# EAGLE design Full_PCB2 (EAGLE 9.6.2)
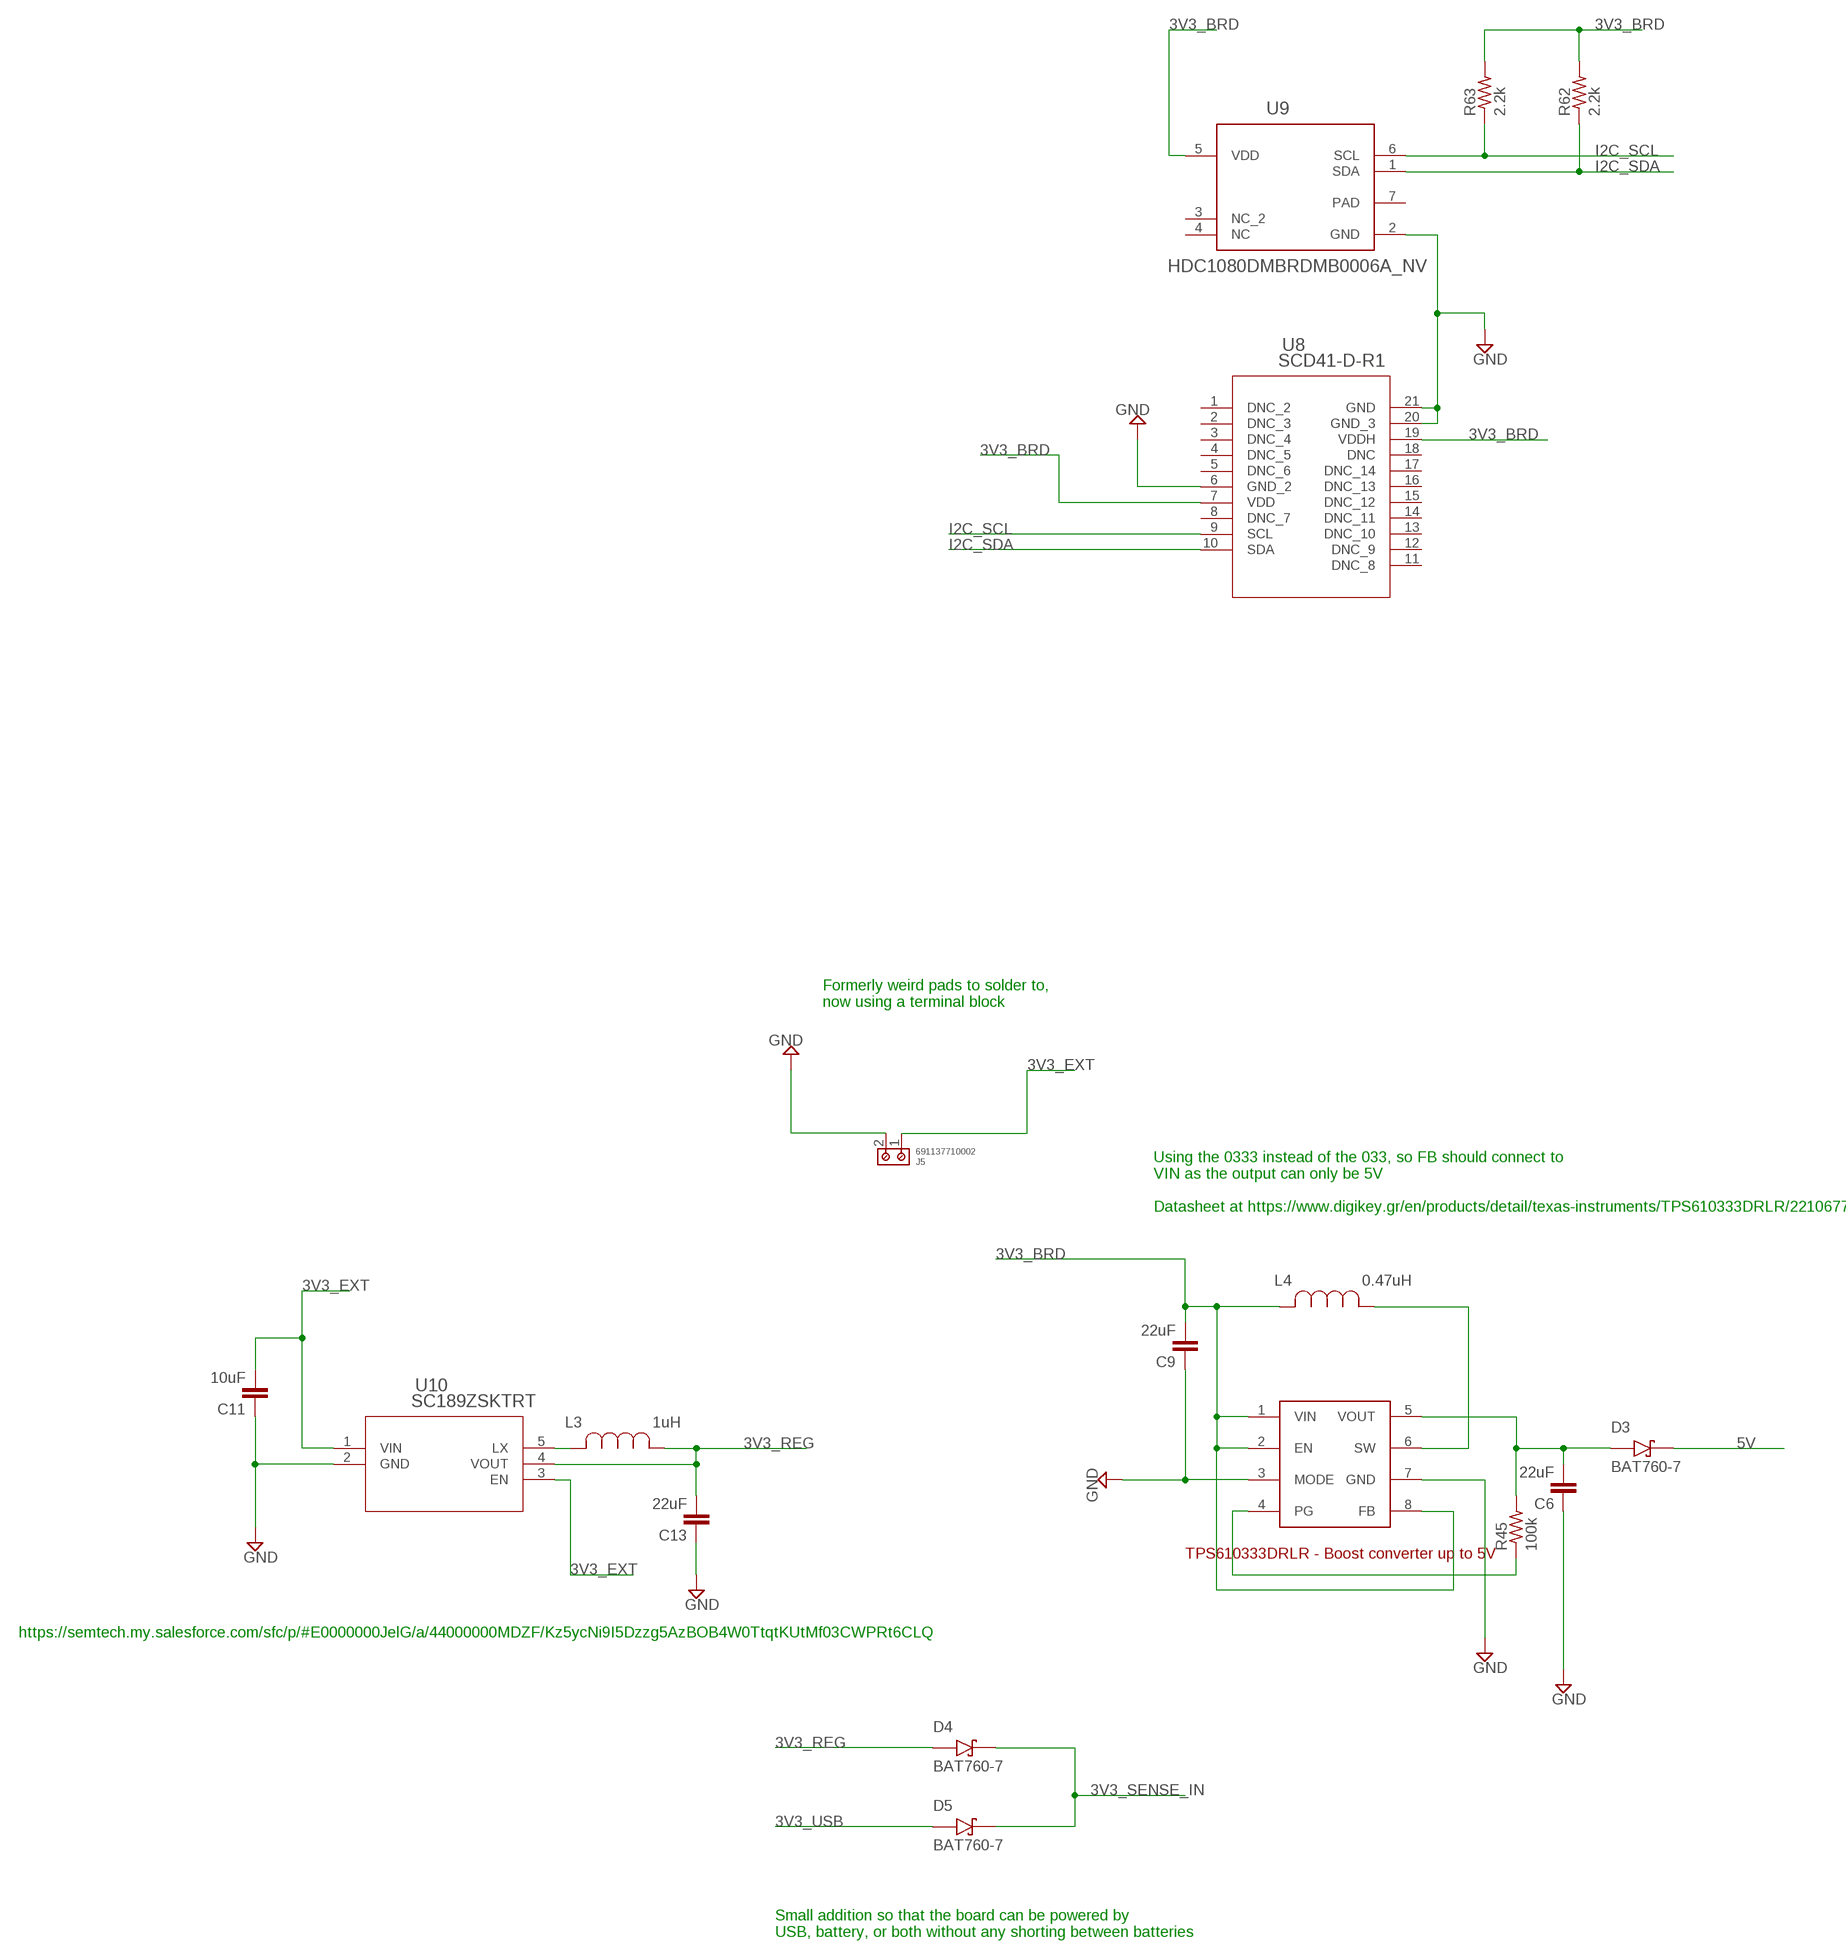
[diagram p0: schematic, sheet 1, part 1 of 3]
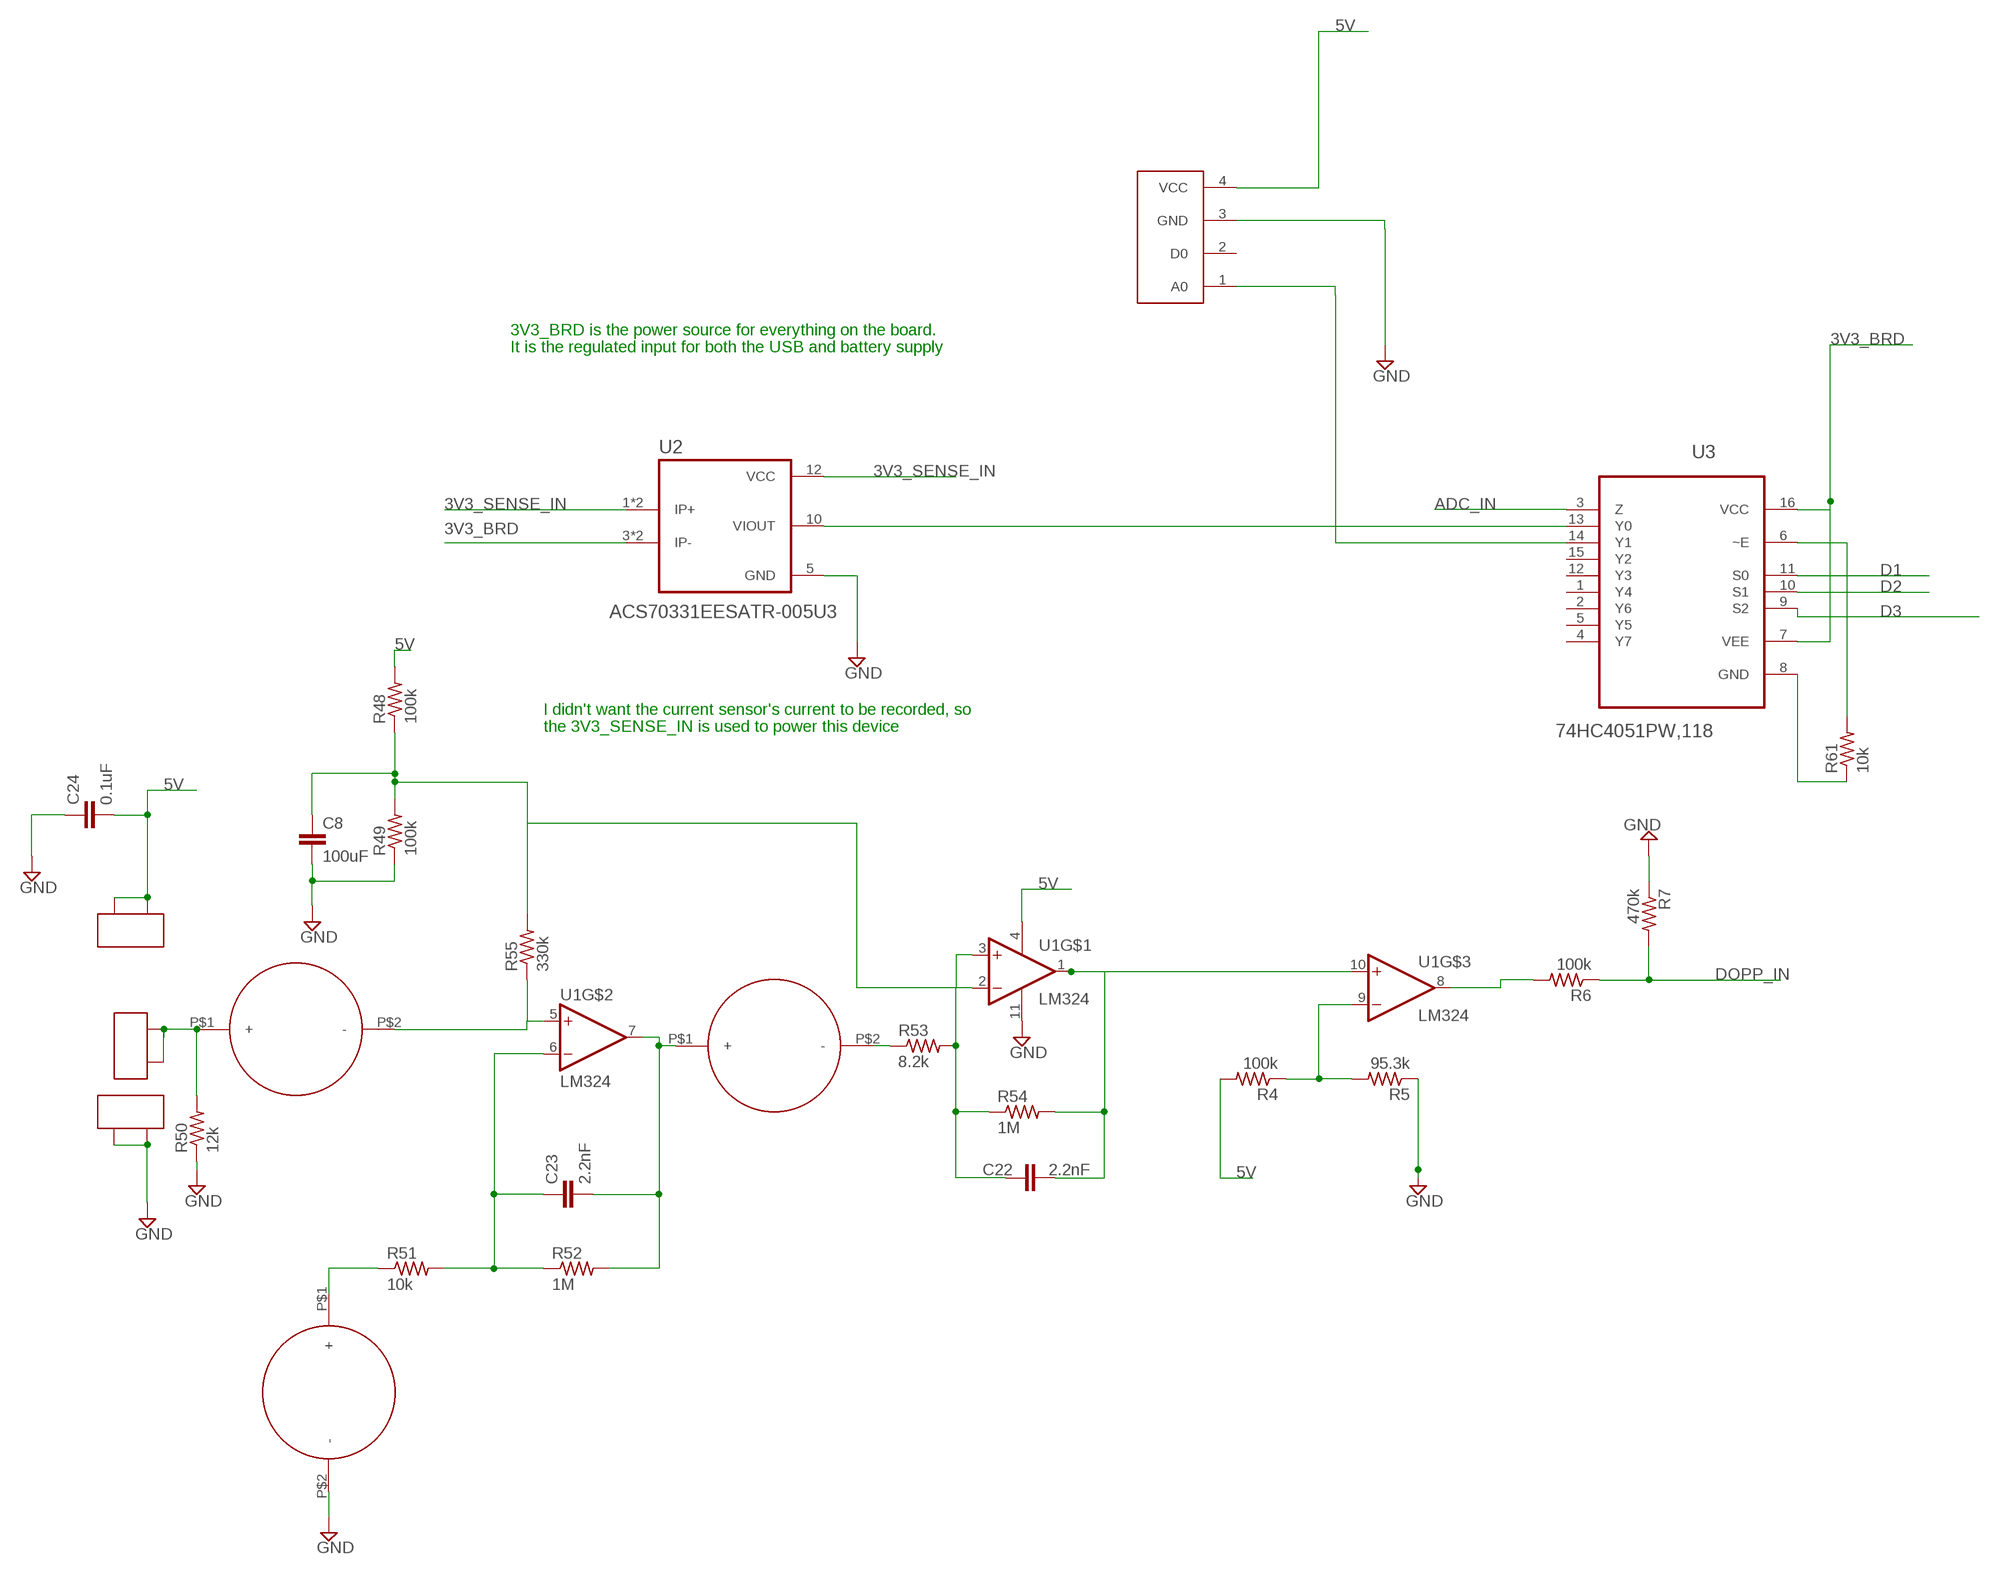
[diagram p1: schematic, sheet 1, part 2 of 3]
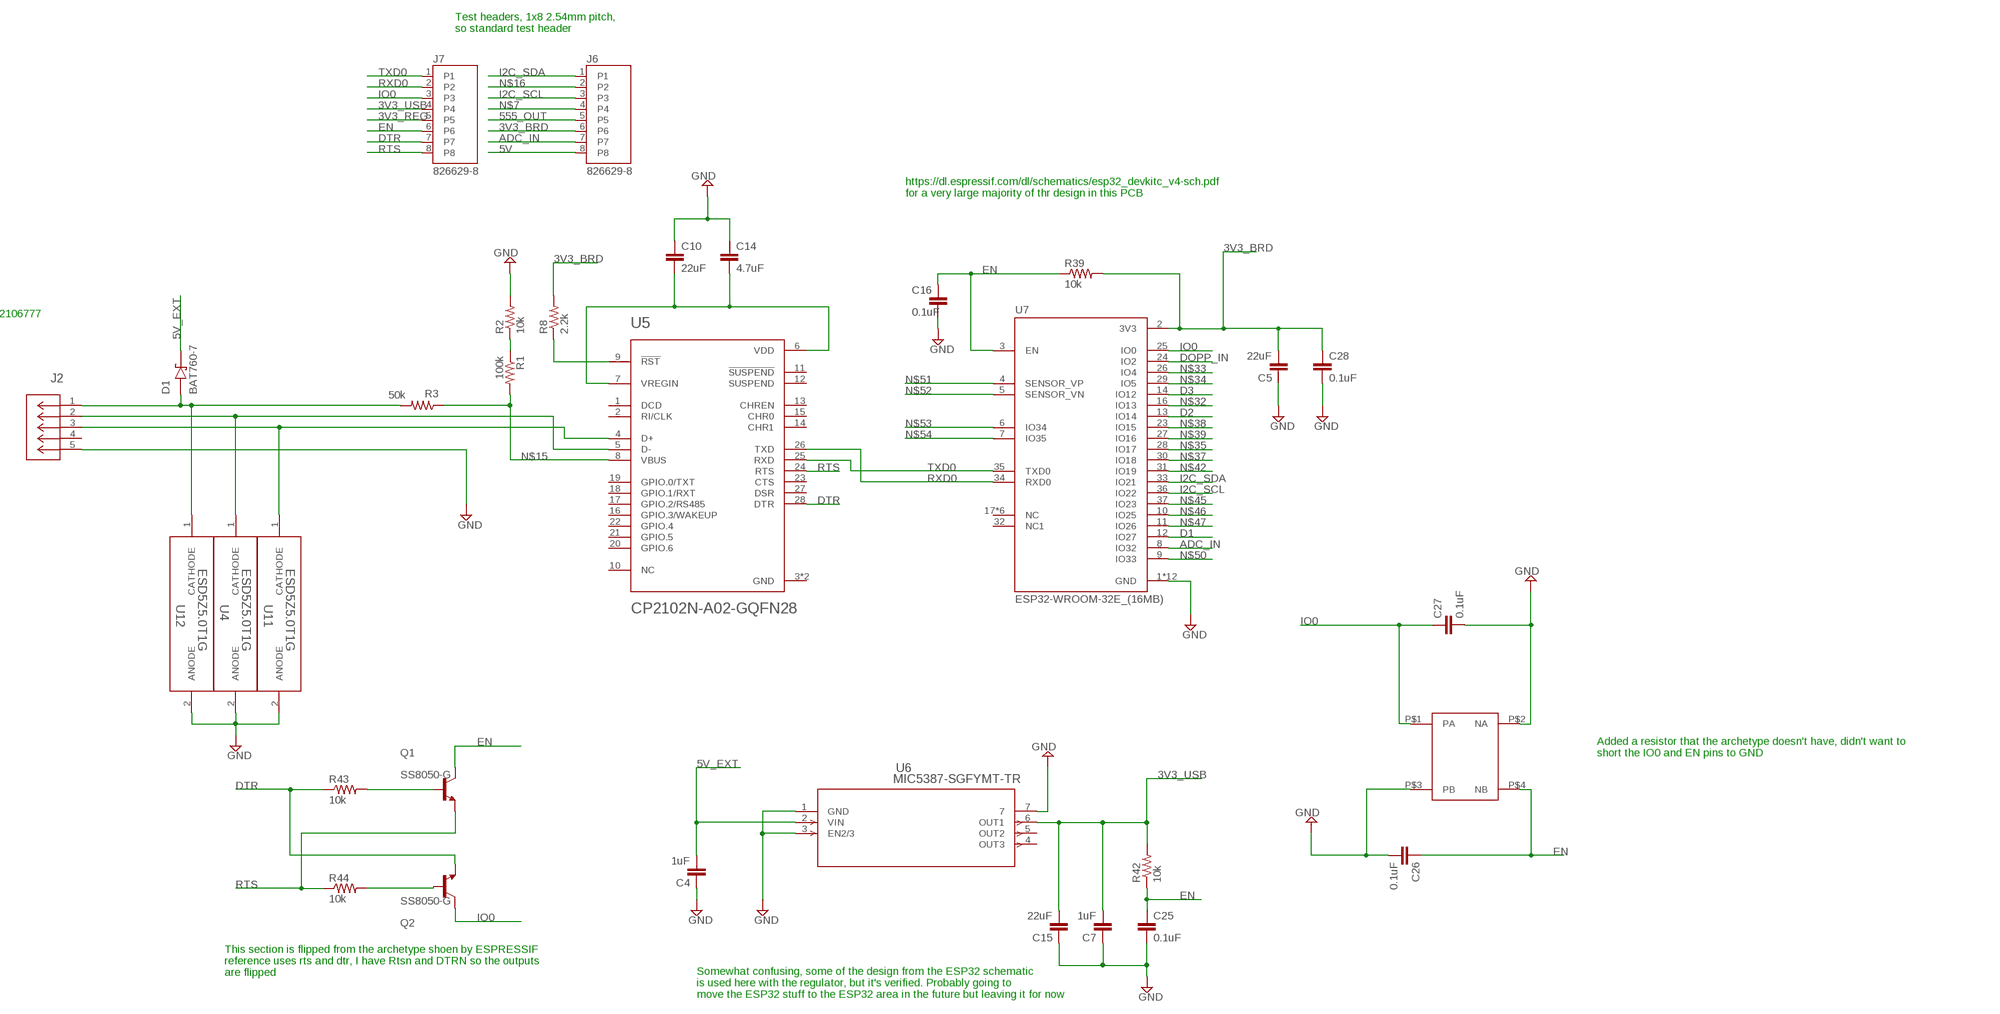
[diagram p2: schematic, sheet 1, part 3 of 3]

## Parts
C4  1uF  C-EUC0603  [C0603]
C5  22uF  C-EUC0603  [C0603]
C6  22uF  C-EUC0603  [C0603]
C7  1uF  C-EUC0603  [C0603]
C8  100uF  C-EUC1206  [C1206]
C9  22uF  C-EUC0603  [C0603]
C10  22uF  C-EUC0805  [C0805]
C11  10uF  C-EUC0603  [C0603]
C13  22uF  C-EUC0603  [C0603]
C14  4.7uF  C-EUC0402  [C0402]
C15  22uF  C-EUC0603  [C0603]
C16  0.1uF  C-EUC0402  [C0402]
C22  2.2nF  C-EUC0402  [C0402]
C23  2.2nF  C-EUC0402  [C0402]
C24  0.1uF  C-EUC0402  [C0402]
C25  0.1uF  C-EUC0402  [C0402]
C26  0.1uF  C-EUC0402  [C0402]
C27  0.1uF  C-EUC0402  [C0402]
C28  0.1uF  C-EUC0402  [C0402]
D1  BAT760-7  [SOD2513X120N]
D3  BAT760-7  [SOD2513X120N]
D4  BAT760-7  [SOD2513X120N]
D5  BAT760-7  [SOD2513X120N]
J2  10118193-0001LF  [CONN_10118193-0001LF_AMP]
J5  691137710002  [691137710002]
J6  826629-8  [TE_826629-8]
J7  826629-8  [TE_826629-8]
L3  1uH  DFE252012P-1R0M=P2  [DFE252012P-1R0M=P2]
L4  0.47uH  DFE252012P-1R0M=P2  [DFE252012P-1R0M=P2]
Q1  SS8050-G  [TRANS_SS8050-G]
Q2  SS8050-G  [TRANS_SS8050-G]
R1  100k  R-US_R0402  [R0402]
R2  10k  R-US_R0402  [R0402]
R3  50k  R-US_R0402  [R0402]
R4  100k  R-US_R0402  [R0402]
R5  95.3k  R-US_R0402  [R0402]
R6  100k  R-US_R0402  [R0402]
R7  470k  R-US_R0402  [R0402]
R8  2.2k  R-US_R0402  [R0402]
R39  10k  R-US_R0402  [R0402]
R42  10k  R-US_R0402  [R0402]
R43  10k  R-US_R0402  [R0402]
R44  10k  R-US_R0402  [R0402]
R45  100k  R-US_R0402  [R0402]
R48  100k  R-US_R0402  [R0402]
R49  100k  R-US_R0402  [R0402]
R50  12k  R-US_R0402  [R0402]
R51  10k  R-US_R0402  [R0402]
R52  1M  R-US_R0402  [R0402]
R53  8.2k  R-US_R0402  [R0402]
R54  1M  R-US_R0402  [R0402]
R55  330k  R-US_R0402  [R0402]
R61  10k  R-US_R0402  [R0402]
R62  2.2k  R-US_R0402  [R0402]
R63  2.2k  R-US_R0402  [R0402]
U1  LM324  [SOIC127P600X175-14N]
U2  ACS70331EESATR-005U3  [ALLEGRO_ACS70331EESATR-005U3]
U3  74HC4051PW,118  [SOP65P640X110-16N]
U4  ESD5Z5.0T1G  [SOD-523_0P9X1P3_ONS]
U5  CP2102N-A02-GQFN28  [QFN50P500X500X80-29N]
U6  MIC5387-SGFYMT-TR  [MLF-6_MT_MCH]
U7  ESP32-WROOM-32E_(16MB)  [XCVR_ESP32-WROOM-32E_(16MB)]
U8  SCD41-D-R1  [SCD41-D-R1_SEN]
U9  HDC1080DMBRDMB0006A_NV  [DMB0006A_NV]
U10  SC189ZSKTRT  [SOT23-5-SC189_SEM]
U11  ESD5Z5.0T1G  [SOD-523_0P9X1P3_ONS]
U12  ESD5Z5.0T1G  [SOD-523_0P9X1P3_ONS]
U14  TPS610333DRLR  [TPS610333DRLR]
U$1  2PIN_HEADER  [2PIN_HEADER]
U$2  2PIN_HEADER  [2PIN_HEADER]
U$3  MQ_7  [MQ-7]
U$5  2PIN_HEADER  [2PIN_HEADER]
U$6  219-2LPST  [219-2LPST]
U$7  865080540002  [865080540002]
U$8  865080540002  [865080540002]
U$9  865080540002  [865080540002]

## Nets
3V3_BRD: C5.2 C9.2 C28.1 J6.6 L4.2 R8.2 R39.2 R62.2 R63.2 U2.3(IP-) U2.4(IP-) U3.7(VEE) U3.16(VCC) U7.2(3V3) U8.7(VDD) U8.19(VDDH) U9.5(VDD) U14.1(VIN) U14.2(EN) U14.8(FB)
3V3_EXT: C11.2 J5.1 U10.1(VIN) U10.3(EN)
3V3_REG: C13.2 D4.A J7.5 L3.1 U10.4(VOUT)
3V3_SENSE_IN: D4.C(K) D5.C(K) U2.1(IP+) U2.2(IP+) U2.12(VCC)
3V3_USB: C7.2 C15.2 D5.A J7.4 R42.2 U6.6(OUT1)
5V: C24.2 D3.C(K) J6.8 R4.2 R48.2 U1.4(VCC+) U$2.1 U$2.2 U$3.4(VCC)
5V1: C6.2 D3.A R45.2 U14.5(VOUT)
5V_EXT: C4.2 D1.C(K) U6.2(VIN)
555_OUT: J6.5
ADC_IN: J6.7 U3.3(Z) U7.8(IO32)
D1: U3.11(S0) U7.12(IO27)
D2: U3.10(S1) U7.13(IO14)
D3: U3.9(S2) U7.14(IO12)
DOPP_IN: R6.1 R7.2 U7.24(IO2)
DTR: J7.7 Q2.2(E) R43.1 U5.28(DTR)
EN: C16.1 C25.1 C26.1 J7.6 Q1.3(C) R39.1 R42.1 U7.3(EN) U$6.P$4(NB)
GND: C4.1 C5.1 C6.1 C7.1 C8.2 C9.1 C10.1 C11.1 C13.1 C14.1 C15.1 C16.2 C24.1 C25.2 C26.2 C27.2 C28.2 J2.5 J5.2 R2.2 R5.1 R7.1 R49.1 R50.1 U1.11(VCC-) U2.5(GND) U4.2(ANODE) U6.1(GND) U6.3(EN2/3) U6.7 U7.1(GND) U7.15(GND) U7.38(GND) U7.39_1(GND) U7.39_2(GND) U7.39_3(GND) U7.39_4(GND) U7.39_5(GND) U7.39_6(GND) U7.39_7(GND) U7.39_8(GND) U7.39_9(GND) U8.6(GND_2) U8.20(GND_3) U8.21(GND) U9.2(GND) U10.2(GND) U11.2(ANODE) U12.2(ANODE) U14.3(MODE) U14.7(GND) U$3.3(GND) U$5.1 U$5.2 U$6.P$2(NA) U$6.P$3(PB) U$7.P$2(-)
I2C_SCL: J6.3 R63.1 U7.36(IO22) U8.9(SCL) U9.6(SCL)
I2C_SDA: J6.1 R62.1 U7.33(IO21) U8.10(SDA) U9.1(SDA)
IO0: C27.1 J7.3 Q2.3(C) U7.25(IO0) U$6.P$1(PA)
N$1: D1.A J2.1 R3.2 U12.1(CATHODE)
N$2: R4.1 R5.2 U1.9(INVERTING_INPUT3)
N$3: C23.1 R51.2 R52.1 U1.6(INVERTING_INPUT2)
N$4: C23.2 R52.2 U1.7(OUTPUT2) U$9.P$1(+)
N$5: R53.1 U$9.P$2(-)
N$6: C22.1 R53.2 R54.1 U1.3(NON-INVERTING_INPUT1)
N$7: J6.4 U2.10(VIOUT) U3.13(Y0)
N$8: R6.2 U1.8(OUTPUT3)
N$10: R51.1 U$7.P$1(+)
N$11: R45.1 U14.4(PG)
N$12: C8.1 R48.1 R49.2 R55.2 U1.2(INVERTING_INPUT1)
N$13: J2.2 U4.1(CATHODE) U5.5(D-)
N$14: J2.3 U5.4(D+) U11.1(CATHODE)
N$15: R1.2 R3.1 U5.8(VBUS)
N$16: J6.2 U3.14(Y1) U$3.1(A0)
N$17: R1.1 R2.1
N$18: R8.1 U5.9(!RST)
N$20: R61.1 U3.8(GND)
N$21: R61.2 U3.6(~E)
N$22: C10.2 C14.2 U5.6(VDD) U5.7(VREGIN)
N$24: Q1.1(B) R43.2
N$25: Q2.1(B) R44.2
N$29: R50.2 U$1.1 U$1.2 U$8.P$1(+)
N$32: U7.16(IO13)
N$33: U7.26(IO4)
N$34: U7.29(IO5)
N$35: U7.28(IO17)
N$37: U7.30(IO18)
N$38: U7.23(IO15)
N$39: U7.27(IO16)
N$42: U7.31(IO19)
N$45: U7.37(IO23)
N$46: U7.10(IO25)
N$47: U7.11(IO26)
N$50: U7.9(IO33)
N$51: U7.4(SENSOR_VP)
N$52: U7.5(SENSOR_VN)
N$53: U7.6(IO34)
N$54: U7.7(IO35)
N$55: L3.2 U10.5(LX)
N$56: L4.1 U14.6(SW)
N$60: R55.1 U1.5(NON-INVERTING_INPUT2) U$8.P$2(-)
RTS: J7.8 Q1.2(E) R44.1 U5.24(RTS)
RXD0: J7.2 U5.26(TXD) U7.34(RXD0)
THRESH_NET: C22.2 R54.2 U1.1(OUTPUT1) U1.10(NON-INVERTING_INPUT3)
TXD0: J7.1 U5.25(RXD) U7.35(TXD0)
Unconnected: J2.4 U1.12(NON-INVERTING_INPUT4) U1.13(INVERTING_INPUT4) U1.14(OUTPUT4) U3.1(Y4) U3.2(Y6) U3.4(Y7) U3.5(Y5) U3.12(Y3) U3.15(Y2) U5.1(DCD) U5.2(RI/CLK) U5.10(NC) U5.11(!SUSPEND) U5.12(SUSPEND) U5.13(CHREN) U5.14(CHR1) U5.15(CHR0) U5.16(GPIO.3/WAKEUP) U5.17(GPIO.2/RS485) U5.18(GPIO.1/RXT) U5.19(GPIO.0/TXT) U5.20(GPIO.6) U5.21(GPIO.5) U5.22(GPIO.4) U5.23(CTS) U5.27(DSR) U6.4(OUT3) U6.5(OUT2) U7.17(NC) U7.18(NC) U7.19(NC) U7.20(NC) U7.21(NC) U7.22(NC) U7.32(NC1) U8.1(DNC_2) U8.2(DNC_3) U8.3(DNC_4) U8.4(DNC_5) U8.5(DNC_6) U8.8(DNC_7) U8.11(DNC_8) U8.12(DNC_9) U8.13(DNC_10) U8.14(DNC_11) U8.15(DNC_12) U8.16(DNC_13) U8.17(DNC_14) U8.18(DNC) U9.3(NC_2) U9.4(NC) U$3.2(D0)

## Notes on the sheet
- 3V3_BRD is the power source for everything on the board.
  It is the regulated input for both the USB and battery supply
- I didn't want the current sensor's current to be recorded, so
  the 3V3_SENSE_IN is used to power this device
- Test headers, 1x8 2.54mm pitch,
  so standard test header
- Formerly weird pads to solder to,
  now using a terminal block
- https://dl.espressif.com/dl/schematics/esp32_devkitc_v4-sch.pdf
  for a very large majority of thr design in this PCB
- Using the 0333 instead of the 033, so FB should connect to 
  VIN as the output can only be 5V
  
  Datasheet at https://www.digikey.gr/en/products/detail/texas-instruments/TPS610333DRLR/22106777
- https://semtech.my.salesforce.com/sfc/p/#E0000000JelG/a/44000000MDZF/Kz5ycNi9I5Dzzg5AzBOB4W0TtqtKUtMf03CWPRt6CLQ
- Added a resistor that the archetype doesn't have, didn't want to 
  short the IO0 and EN pins to GND
- Small addition so that the board can be powered by
  USB, battery, or both without any shorting between batteries
- This section is flipped from the archetype shoen by ESPRESSIF
  reference uses rts and dtr, I have Rtsn and DTRN so the outputs
  are flipped
- Somewhat confusing, some of the design from the ESP32 schematic
  is used here with the regulator, but it's verified. Probably going to 
  move the ESP32 stuff to the ESP32 area in the future but leaving it for now

## Power pins joined to a net without a drawn wire
GND: U5.3(GND) U5.29(GND)
PAD: U9.7(PAD)

## Library data of the parts
C4-C11 C13-C16 C22-C28 = rcl:C-EU: CAPACITOR, European symbol; SPICEPREFIX: C
D1 D3-D5 = BAT760-7:BAT760-7: Diode Schottky 30V 1A Surface Mount SOD-323; MANUFACTURER: DIODES; MAXIMUM_PACKAGE_HEIGHT: 1.20mm; PARTREV: 9-2; STANDARD: IPC-7351B
J2 = USB:10118193-0001LF; COPYRIGHT: Copyright (C) 2024 Ultra Librarian. All rights reserved.; MANUFACTURER_PART_NUMBER: 10118193-0001LF; MFR_NAME: Amphenol ICC; TYPE: USB, DVI, HDMI, Connectors
J5 = 691137710002:691137710002: WR-TBL Serie 1377 - 5.00 mm Horiz Entry w. Pressure Clamp Glow Wire KIND PROPERTIES Pitch 5 mm MATERIAL PROPERTIES Insulator Material PA6/66 Insulator Flammability Rating UL94 V-0 Insulator Color Green Contact Material Copper Alloy Contact Plating Tin over Nickel Terminal Screw Material Steel Terminal Screw Plating Zinc Wire Guard Material Copper Alloy with Tin GENERAL INFORMATION Operating Temperature -30 up to +120 °C Compliance Lead free / RoHS ELECTRICAL PROPERTIES IR UL 16 A IR VDE 24 A Working Voltage [UL] 300 V (AC) Working Voltage [VDE] 250 V (AC) Withstanding Voltage [UL] 1600 V (AC) Withstanding Voltage [VDE] 2000 V (AC) Contact Resistance 20 mΩ Contact Resistance [UL] 20 mΩ Contact Resistance [VDE] 20 mΩ MECHANICAL PROPERTIES Wire Strip Length 6 (mm) Screw M2.5 Solid Wire Section (AWG) 12 to 30 (AWG) Solid Wire Section (Metric) 3.31 to 0.05 (mm²) Stranded Wire Section (AWG) 12 to 30 (AWG) Stranded Wire Section (Metric) 3.31 to 0.05 (mm²) CERTIFICATION UL Approval E150931 VDE Approval 40021397 PACKAGING PROPERTIES Packaging Box <https://katalog.we-online.com/media/images/v2/o84014v209%20Family_WR-TBL1_6911377100xx.jpg> Details see: https://katalog.we-online.com/en/em/TBL_5_00_1377_HORIZONTAL_ENTRY_W_PRESSURE_CLAMP_GLOW_WIRE_6911377100xx Updated by Ella Wu 2019-11-08 2019(C) Wurth Elektronik Check availability <https://pricing.snapeda.com/parts/691137710002/Wurth%20Electronics/view-part?ref=eda>; AVAILABILITY: In Stock; CHECK_PRICES: https://www.snapeda.com/parts/691137710002/Wurth+Electronics+Inc./view-part/?ref=eda; DESCRIPTION: 2 Position Wire to Board Terminal Block Horizontal with Board 0.197 (5.00mm) Through Hole; MF: Wurth Electronics; MP: 691137710002; PACKAGE: None; PRICE: None; PURCHASE-URL: https://www.snapeda.com/api/url_track_click_mouser/?unipart_id=1195404&manufacturer=Wurth Electronics&part_name=691137710002&search_term=None; SNAPEDA_LINK: https://www.snapeda.com/parts/691137710002/Wurth+Electronics+Inc./view-part/?ref=snap
J6 J7 = 826629-8:826629-8: Pin header; pin strips; AMPMODU MOD II; male; PIN: 8; straight Check availability <https://pricing.snapeda.com/parts/826629-8/TE%20Connectivity/view-part?ref=eda>; AVAILABILITY: In Stock; CHECK_PRICES: https://www.snapeda.com/parts/826629-8/TE+Connectivity+AMP+Connectors/view-part/?ref=eda; COMMENT: 826629-8; DESCRIPTION: Conn Unshrouded Header HDR 8 POS 2.54mm Solder ST Thru-Hole Automotive Box; EU_ROHS_COMPLIANCE: Compliant; MF: TE Connectivity; MP: 826629-8; PACKAGE: None; PRICE: None; PURCHASE-URL: https://www.snapeda.com/api/url_track_click_mouser/?unipart_id=456641&manufacturer=TE Connectivity&part_name=826629-8&search_term=None; SNAPEDA_LINK: https://www.snapeda.com/parts/826629-8/TE+Connectivity+AMP+Connectors/view-part/?ref=snap
L3 L4 = 2520_Inductor:DFE252012P-1R0M=P2: Inductor of size 2520 metric; COPYRIGHT: Copyright (C) 2024 Ultra Librarian. All rights reserved.; MANUFACTURER_PART_NUMBER: DFE252012P-1R0M=P2; MFR_NAME: Murata
Q1 Q2 = SS8050-G:SS8050-G: Bipolar (BJT) Transistor NPN 25 V 1.5 A 100MHz 300 mW Surface Mount SOT-23-3; MANUFACTURER: Comchip; MAXIMUM_PACKAGE_HEIGHT: 1.05 mm; PARTREV: A; STANDARD: Manufacturer Recommendations
R1-R8 R39 R42-R45 R48-R55 R61-R63 = rcl:R-US_: RESISTOR, American symbol; SPICEPREFIX: R
U1 = LM324:LM324: these devices consist of four independent high-gain frequency-compensated operational amplifiers that are designed sp... Check availability <https://pricing.snapeda.com/parts/LM324../Intersil/view-part?ref=eda>; AVAILABILITY: Not in stock; CHECK_PRICES: https://www.snapeda.com/parts/LM324../Intersil/view-part/?ref=eda; DESCRIPTION: Op Amp Quad Low Voltage Amplifier ±2.75V/5.5V 14-Pin SOIC T/R; MF: Intersil; MP: LM324..; PACKAGE: None; PRICE: None; SNAPEDA_LINK: https://www.snapeda.com/parts/LM324../Intersil/view-part/?ref=snap
U2 = ACS70331EESATR-005U3:ACS70331EESATR-005U3: High Sensitivity, 1 Mhz, Gmr-Bas Check availability <https://pricing.snapeda.com/parts/ACS70331EESATR-005U3/Allegro%20MicroSystems%20LLC/view-part?ref=eda>; AVAILABILITY: In Stock; CHECK_PRICES: https://www.snapeda.com/parts/ACS70331EESATR-005U3/Allegro+MicroSystems+LLC/view-part/?ref=eda; DESCRIPTION: Current Sensor 5A 1 Channel Hall Effect, Open Loop Unidirectional 12-PowerWFQFN; MF: Allegro MicroSystems LLC; MP: ACS70331EESATR-005U3; PACKAGE: WFQFN-12 Allegro MicroSystems LLC; PRICE: None; PURCHASE-URL: https://www.snapeda.com/api/url_track_click_mouser/?unipart_id=2732756&manufacturer=Allegro MicroSystems LLC&part_name=ACS70331EESATR-005U3&search_term=None; SNAPEDA_LINK: https://www.snapeda.com/parts/ACS70331EESATR-005U3/Allegro+MicroSystems+LLC/view-part/?ref=snap
U3 = 74HC4051PW_118:74HC4051PW,118: 8-channel analog multiplexer/demultiplexer Check availability <https://pricing.snapeda.com/parts/74HC4051PW%2C118/Nexperia%20USA%20Inc./view-part?ref=eda>; AVAILABILITY: In Stock; CHECK_PRICES: https://www.snapeda.com/parts/74HC4051PW,118/Nexperia/view-part/?ref=eda; DESCRIPTION: 1 Circuit IC Switch 8:1 120Ohm 16-TSSOP; MF: Nexperia USA Inc.; MP: 74HC4051PW,118; PACKAGE: TSSOP-16 Texas Instruments; PRICE: None; PURCHASE-URL: https://www.snapeda.com/api/url_track_click_mouser/?unipart_id=5160680&manufacturer=Nexperia USA Inc.&part_name=74HC4051PW,118&search_term=None; SNAPEDA_LINK: https://www.snapeda.com/parts/74HC4051PW,118/Nexperia/view-part/?ref=snap
U4 U11 U12 = Circuit_protection_diode:ESD5Z5.0T1G; COPYRIGHT: Copyright (C) 2024 Ultra Librarian. All rights reserved.; MANUFACTURER_PART_NUMBER: ESD5Z5.0T1G; MFR_NAME: onsemi
U5 = CP2102N-A02-GQFN28:CP2102N-A02-GQFN28; MANUFACTURER: Silicon Labs; MAXIMUM_PACKAGE_HEIGHT: 0.8 mm; PARTREV: 1.5; STANDARD: IPC 7351B
U6 = MIC5387_5V_to_3V3:MIC5387-SGFYMT-TR; COPYRIGHT: Copyright (C) 2024 Ultra Librarian. All rights reserved.; MANUFACTURER_PART_NUMBER: MIC5387-SGFYMT-TR; MFR_NAME: Microchip
U7 = ESP32-WROOM-32E__16MB_:ESP32-WROOM-32E_(16MB): Check availability <https://pricing.snapeda.com/parts/ESP32-WROOM-32E%20%2816MB%29/Espressif%20Systems/view-part?ref=eda>; AVAILABILITY: Not in stock; CHECK_PRICES: https://www.snapeda.com/parts/ESP32-WROOM-32E%20(16MB)/Espressif+Systems/view-part/?ref=eda; DESCRIPTION: Bluetooth, WiFi 802.11b/g/n, Bluetooth v4.2 +EDR, Class 1, 2 and 3 Transceiver Module 2.4GHz ~ 2.5GHz Integrated, Trace Surface Mount; MF: Espressif Systems; MP: ESP32-WROOM-32E (16MB); PACKAGE: SMD-44 Espressif Systems; PRICE: None; SNAPEDA_LINK: https://www.snapeda.com/parts/ESP32-WROOM-32E%20(16MB)/Espressif+Systems/view-part/?ref=snap
U8 = SCD41:SCD41-D-R1: SCD41 is a CO2 sensor that supports I2C communication and can read 400ppm to 5000ppm; COPYRIGHT: Copyright (C) 2024 Ultra Librarian. All rights reserved.; MANUFACTURER_PART_NUMBER: SCD41-D-R1; MFR_NAME: Sensirion
U9 = Temperature_Humidity_Sensor:HDC1080DMBR: Temperature and humidity sensor that functions over I2C protocol; COPYRIGHT: Copyright (C) 2024 Ultra Librarian. All rights reserved.; MANUFACTURER_PART_NUMBER: HDC1080DMBR; MFR_NAME: Texas Instruments; REFDES: RefDes; TYPE: TYPE
U10 = SC189ZSKTRT_3V3:SC189ZSKTRT; COPYRIGHT: Copyright (C) 2024 Ultra Librarian. All rights reserved.; MANUFACTURER_PART_NUMBER: SC189ZSKTRT; MFR_NAME: Semtech
U14 = TPS610333DRLR:TPS610333DRLR: TPS610333DRLR is a linear boost converter that takes an input of 3V-4.35V and outputs 5V
U$1 U$2 U$5 = 2PIN_HEADER:2PIN_HEADER
U$3 = MQ_7:MQ_7: MQ_7 gas sensor, this part can be used for all of the 'MQ' series of gas sensors (the dev board not the sensor by itself)
U$6 = 219-2LPST:219-2LPST
U$7-U$9 = 865080540002:865080540002

## Board
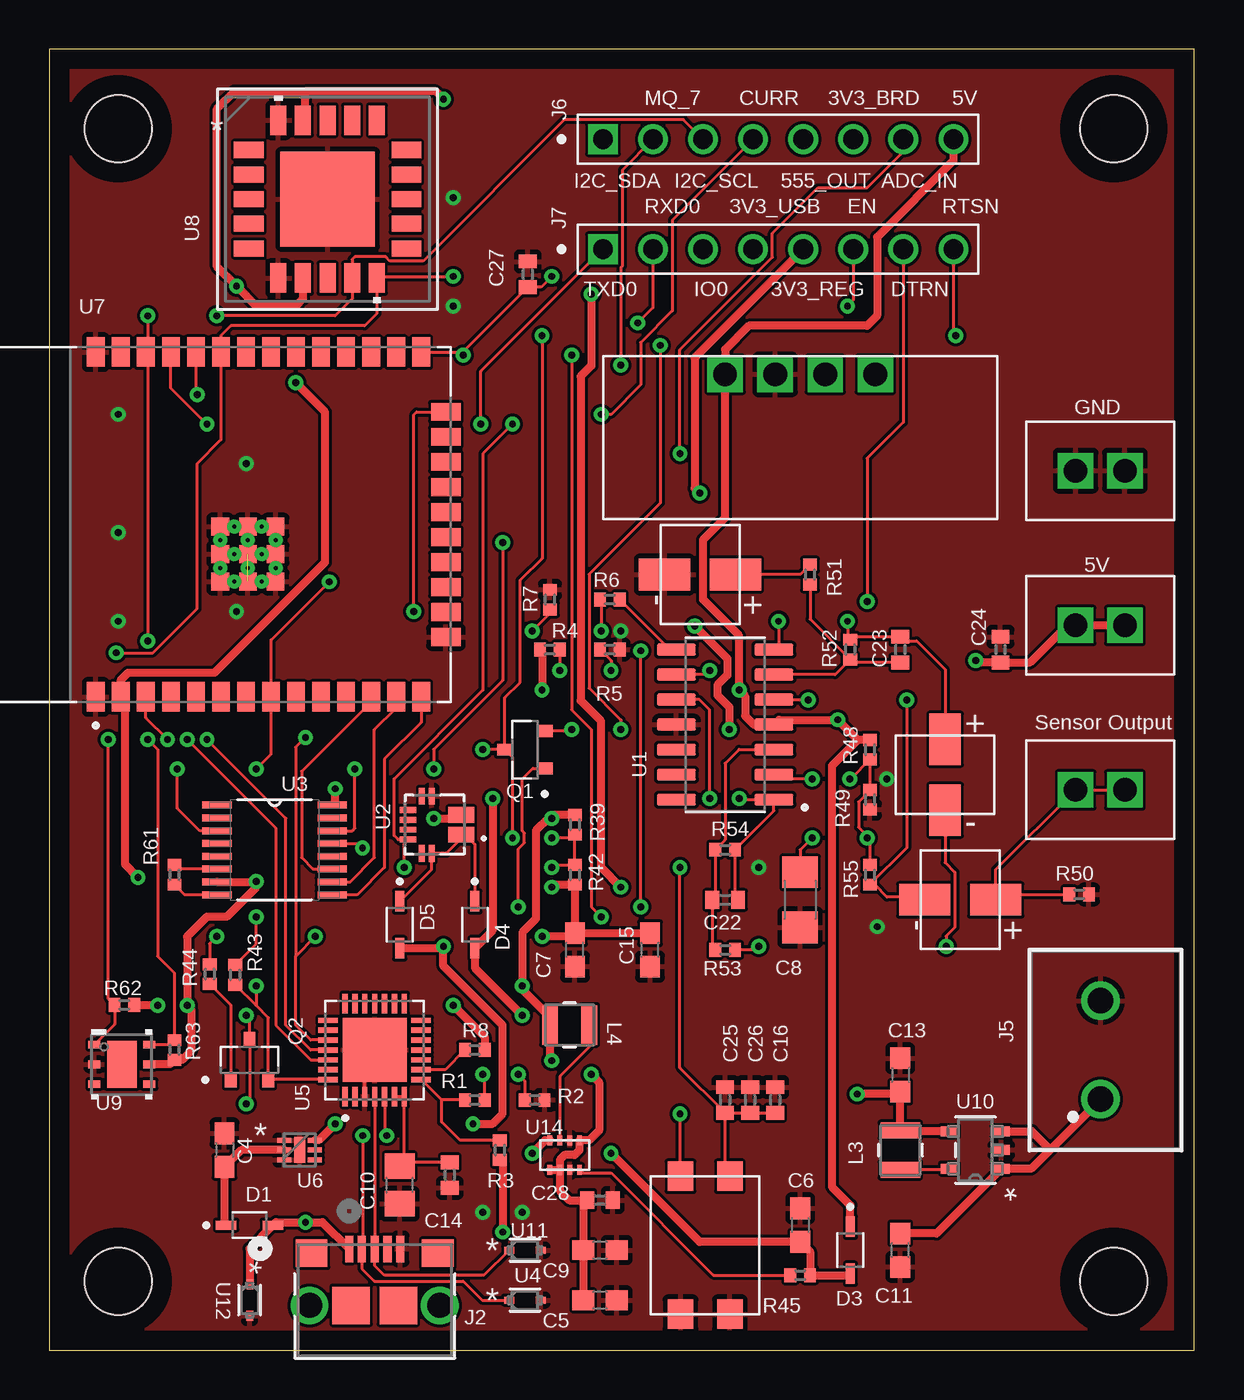
[diagram p3: board, top side]
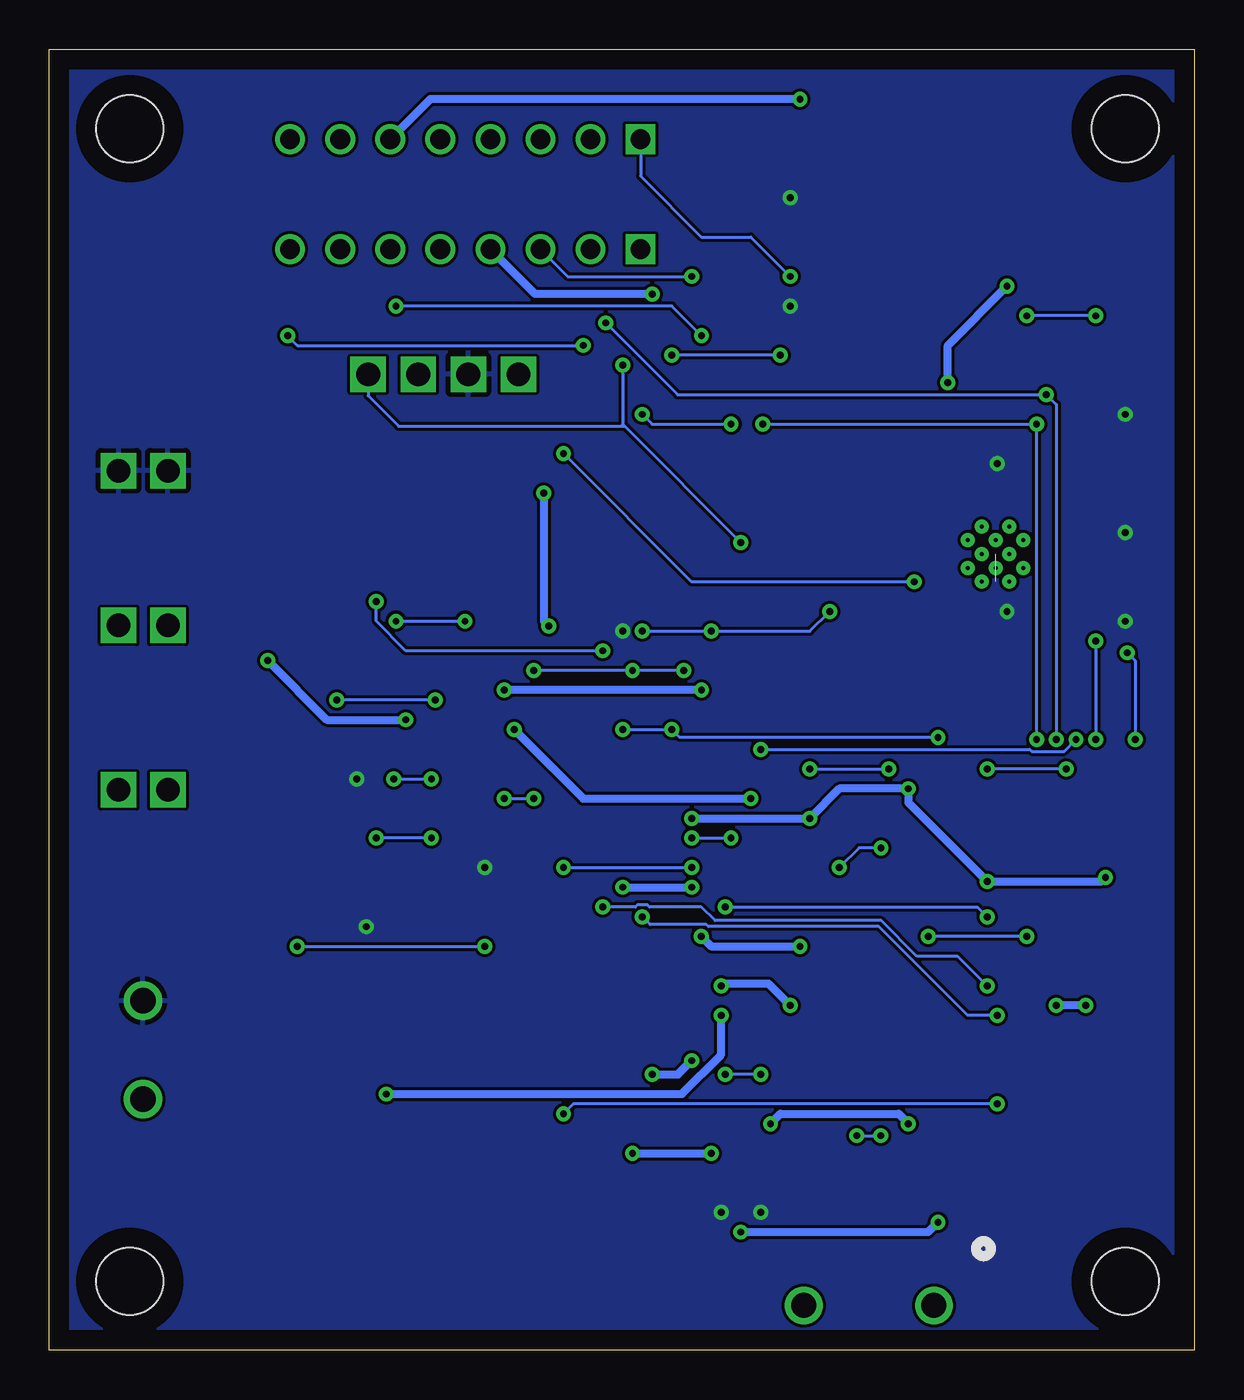
[diagram p4: board, bottom side, seen from below]

Size 58.09 x 66.03 mm. Coordinates in mm from the lower left corner, seen from the top.
Outline: 0,0 58.09,0 58.09,66.03 0,66.03 0,0
Copper layers (1*16): Top 0.035mm / dielectric 1.5mm / Bottom 0.035mm
Design rules "default": minimum track width 6mil, minimum drill 0.35mm, track to track 6mil, track to pad 6mil, pad to pad 6mil, via to via 6mil, smd to smd 6mil, copper to edge 40mil, drill to drill 6mil, minimum pad ring 10mil, minimum via ring 8mil, stop-mask expansion 4mil, vias tented up to drill 0mil, thermal gap 10mil
Holes 3.4 mm at 3.5,3.5 54,3.5 54,62 3.5,62

### Footprints (pad centres in the part's own frame; a part is rotated, then mirrored left to right if it is on the bottom)
C0603 = smd 1.1 x 1: 1 -0.85,0; 2 0.85,0
C1206 = smd 1.6 x 1.8: 1 -1.4,0; 2 1.4,0
C0805 = smd 1.3 x 1.5: 1 -0.95,0; 2 0.95,0
C0402 = smd 0.7 x 0.9: 1 -0.65,0; 2 0.65,0
SOD2513X120N = smd 1.04 x 0.46: A 1.19,0; C -1.19,0
CONN_10118193-0001LF_AMP = smd 0.406 x 1.346: 1 -1.3,2.607; 2 -0.65,2.607; 3 0,2.607; 4 0.65,2.607; 5 1.3,2.607 | smd 1.6 x 1.397: 6 -3.2,2.382; 7 3.2,2.382 | smd 1.905 x 1.905: 8 -1.2,-0.268; 9 1.2,-0.268 | drill 1.27 pad 1.6: P$1 -3.3,-0.268; P$2 3.3,-0.268
691137710002 = drill 1.3: 1 -2.5,0; 2 2.5,0
TE_826629-8 = drill 1 square: 1 0,0 | drill 1: 2 2.54,0; 3 5.08,0; 4 7.62,0; 5 10.16,0; 6 12.7,0; 7 15.24,0; 8 17.78,0
DFE252012P-1R0M=P2 = smd 0.8 x 2.007: 1 -1,0; 2 1,0
TRANS_SS8050-G = smd 0.8 x 0.6: 1 -1.01,0.95; 2 -1.01,-0.95; 3 1.01,0
R0402 = smd 0.6 x 0.7: 1 -0.5,0; 2 0.5,0
SOIC127P600X175-14N = smd 1.97 x 0.6: 1 -2.475,3.81; 2 -2.475,2.54; 3 -2.475,1.27; 4 -2.475,0; 5 -2.475,-1.27; 6 -2.475,-2.54; 7 -2.475,-3.81; 8 2.475,-3.81; 9 2.475,-2.54; 10 2.475,-1.27; 11 2.475,0; 12 2.475,1.27; 13 2.475,2.54; 14 2.475,3.81
ALLEGRO_ACS70331EESATR-005U3 = smd 1.3 x 0.4: 1 -1.35,0.7; 2 -1.35,0.3; 3 -1.35,-0.3; 4 -1.35,-0.7 | smd 0.3 x 0.85: 5 0.15,-1.45; 6 0.65,-1.45; 11 0.65,1.45; 12 0.15,1.45 | smd 0.85 x 0.3: 7 1.35,-0.75; 8 1.35,-0.25; 9 1.35,0.25; 10 1.35,0.75
SOP65P640X110-16N = smd 1.473 x 0.356: 1 -2.921,2.286; 2 -2.921,1.626; 3 -2.921,0.965; 4 -2.921,0.33; 5 -2.921,-0.33; 6 -2.921,-0.965; 7 -2.921,-1.626; 8 -2.921,-2.286; 9 2.921,-2.286; 10 2.921,-1.626; 11 2.921,-0.965; 12 2.921,-0.33; 13 2.921,0.33; 14 2.921,0.965; 15 2.921,1.626; 16 2.921,2.286
SOD-523_0P9X1P3_ONS = smd 0.508 x 0.356: 1 -0.8,0; 2 0.8,0
QFN50P500X500X80-29N = smd 0.99 x 0.27: 1 -2.36,1.5; 2 -2.36,1; 3 -2.36,0.5; 4 -2.36,0; 5 -2.36,-0.5; 6 -2.36,-1; 7 -2.36,-1.5; 15 2.36,-1.5; 16 2.36,-1; 17 2.36,-0.5; 18 2.36,0; 19 2.36,0.5; 20 2.36,1; 21 2.36,1.5 | smd 0.27 x 0.99: 8 -1.5,-2.36; 9 -1,-2.36; 10 -0.5,-2.36; 11 0,-2.36; 12 0.5,-2.36; 13 1,-2.36; 14 1.5,-2.36; 22 1.5,2.36; 23 1,2.36; 24 0.5,2.36; 25 0,2.36; 26 -0.5,2.36; 27 -1,2.36; 28 -1.5,2.36 | smd 3.25 x 3.25: 29 0,0
MLF-6_MT_MCH = smd 0.711 x 0.254: 1 -0.775,0.5; 2 -0.775,0; 3 -0.775,-0.5; 4 0.775,-0.5; 5 0.775,0; 6 0.775,0.5 | smd 0.559 x 1.321: 7 0,0
XCVR_ESP32-WROOM-32E_(16MB) = smd 1.5 x 0.9: 1 -8.75,5.26; 2 -8.75,3.99; 3 -8.75,2.72; 4 -8.75,1.45; 5 -8.75,0.18; 6 -8.75,-1.09; 7 -8.75,-2.36; 8 -8.75,-3.63; 9 -8.75,-4.9; 10 -8.75,-6.17; 11 -8.75,-7.44; 12 -8.75,-8.71; 13 -8.75,-9.98; 14 -8.75,-11.25; 25 8.75,-11.25; 26 8.75,-9.98; 27 8.75,-8.71; 28 8.75,-7.44; 29 8.75,-6.17; 30 8.75,-4.9; 31 8.75,-3.63; 32 8.75,-2.36; 33 8.75,-1.09; 34 8.75,0.18; 35 8.75,1.45; 36 8.75,2.72; 37 8.75,3.99; 38 8.75,5.26 | smd 0.9 x 1.5: 15 -5.715,-12.5; 16 -4.445,-12.5; 17 -3.175,-12.5; 18 -1.905,-12.5; 19 -0.635,-12.5; 20 0.635,-12.5; 21 1.905,-12.5; 22 3.175,-12.5; 23 4.445,-12.5; 24 5.715,-12.5 | smd 0.9 x 0.9: 39_1 -2.9,-1.06; 39_2 -1.5,-1.06; 39_3 -0.1,-1.06; 39_4 -2.9,-2.46; 39_5 -1.5,-2.46; 39_6 -0.1,-2.46; 39_7 -2.9,-3.86; 39_8 -1.5,-3.86; 39_9 -0.1,-3.86 | drill 0.2 pad 0.3: 39_10 -2.2,-1.06; 39_11 -0.8,-1.06; 39_12 -2.9,-1.76; 39_13 -1.5,-1.76; 39_14 -0.1,-1.76; 39_15 -2.2,-2.46; 39_16 -0.8,-2.46; 39_17 -2.9,-3.16; 39_18 -1.5,-3.16; 39_19 -0.1,-3.16; 39_20 -2.2,-3.86; 39_21 -0.8,-3.86
SCD41-D-R1_SEN = smd 1.499 x 0.813: 1 -4,2.5; 2 -4,1.25; 3 -4,0; 4 -4,-1.25; 5 -4,-2.5; 11 4,-2.5; 12 4,-1.25; 13 4,0; 14 4,1.25; 15 4,2.5 | smd 0.813 x 1.499: 6 -2.5,-4; 7 -1.25,-4; 8 0,-4; 9 1.25,-4; 10 2.5,-4; 16 2.5,4; 17 1.25,4; 18 0,4; 19 -1.25,4; 20 -2.5,4 | smd 4.801 x 4.801: 21 0,0
DMB0006A_NV = smd 0.6 x 0.4: 1 -1.4,1; 2 -1.4,0; 3 -1.4,-1; 4 1.4,-1; 5 1.4,0; 6 1.4,1 | smd 1.5 x 2.4: 7 0,0
SOT23-5-SC189_SEM = smd 0.876 x 0.508: 1 -1.314,0.95; 2 -1.314,0; 3 -1.314,-0.95; 4 1.314,-0.95; 5 1.314,0.95
TPS610333DRLR = smd 0.5 x 0.25: 1 -1,0; 2 -1,-0.5; 3 -1,-1; 4 -1,-1.5; 5 0.5,0; 6 0.5,-0.5; 7 0.5,-1; 8 0.5,-1.5
2PIN_HEADER = drill 1.2 pad 1.676 square: 1 -2.5,0; 2 0,0
MQ-7 = drill 1.2 square: 1 -3.81,0; 2 -1.27,0; 3 1.27,0; 4 3.81,0
219-2LPST = smd 1.3 x 1.5: P$1 -1.5,3.5; P$2 -1.5,-3.5; P$3 1,-3.5; P$4 1,3.5
865080540002 = smd 1.6 x 2.6: P$1 0,1.8; P$2 0,-1.8

### Placement (x,y rotation side)
C4  8.89,10.16 270 top
C5  27.94,2.54 180 top
C6  38.1,6.35 270 top
C7  26.67,20.32 90 top
C8  38.1,22.86 270 top
C9  27.94,5.08 180 top
C10  17.78,8.39 90 top
C11  43.18,5.08 90 top
C13  43.18,13.97 270 top
C14  20.32,8.89 90 top
C15  30.48,20.32 90 top
C16  36.83,12.7 90 top
C22  34.29,22.86 0 top
C23  43.18,35.56 90 top
C24  48.26,35.56 270 top
C25  34.29,12.7 90 top
C26  35.56,12.7 90 top
C27  24.28,54.61 90 top
C28  27.94,7.62 0 top
D1  10.16,6.35 0 top
D3  40.64,5.08 270 top
D4  21.59,21.59 270 top
D5  17.78,21.59 270 top
J2  16.51,2.54 0 top
J5  53.34,15.24 90 top
J6  28.09,61.46 0 top
J7  28.09,55.88 0 top
L3  43.18,10.16 270 top
L4  26.4,16.51 180 top
Q1  24.13,30.48 180 top
Q2  10.16,14.74 90 top
R1  21.59,12.7 180 top
R2  24.63,12.7 0 top
R3  22.86,10.16 270 top
R4  25.4,35.56 180 top
R5  28.44,35.56 180 top
R6  28.44,38.1 0 top
R7  25.4,38.1 270 top
R8  21.59,15.24 0 top
R39  26.67,26.67 90 top
R42  26.67,24.13 270 top
R43  9.43,19.05 90 top
R44  8.14,19.09 270 top
R45  38.1,3.81 0 top
R48  41.64,30.48 90 top
R49  41.64,27.94 90 top
R50  52.25,23.13 180 top
R51  38.6,39.37 270 top
R52  40.64,35.56 90 top
R53  34.29,20.32 180 top
R54  34.29,25.4 0 top
R55  41.64,24.13 90 top
R61  6.35,24.13 90 top
R62  3.81,17.53 0 top
R63  6.35,15.24 270 top
U1  34.29,31.75 180 top
U2  19.55,26.67 180 top
U3  11.43,25.4 0 top
U4  24.13,2.54 0 top
U5  16.51,15.24 90 top
U6  12.7,10.16 0 top
U7  7.62,41.91 90 top
U8  14.12,58.42 0 top
U9  3.68,14.51 0 top
U10  46.99,10.16 180 top
U11  24.13,5.08 0 top
U12  10.16,2.54 270 top
U14  25.4,10.16 90 top
U$1  52.07,28.44 180 top
U$2  52.07,36.79 180 top
U$3  38.1,49.53 180 top
U$5  52.07,44.64 180 top
U$6  33.53,5.33 0 top
U$7  33.02,39.37 270 top
U$8  46.22,22.86 270 top
U$9  45.45,29.21 0 top

### Tracks (layer width: path | path; a pad name or v marks a point on that pad's centre or on a via)
3V3_BRD  (via drill 0.35)
  Top 0.4: U9.5 6.12,14.51 R63.2 6.75,14.74 7.2,15.19 7.2,17.3 v7,17.5 7,21 8,22 9,22 10.5,23.5 v10.5,23.8 10.47,23.77 U3.7 | R62.2 5.47,17.53 v5.5,17.5 | R39.2 25.67,27.17 v25.5,27 25.31,27 24.69,26.38 24.69,21.89 24,21.2 v24,18.5 24,18.31 25.4,16.91 L4.2 25.4,14.8 v25.5,14.7 | v19.5,27 20.87,27 | 20.87,27 U2.3 | v4.5,24 3.83,24.67 3.83,32.96 U7.2 3.63,34.02 4,34.39 8.39,34.39 14,40 14,47.61 v12.5,49.11 | U3.16 14.5,27.84 v14.5,28.5 | v27.5,14 27.9,13.6 27.9,11.16 27.4,10.66 U14.8 26.9,10.16 26.66,9.91 26.15,9.91 25.9,9.66 U14.2 | U14.2 25.9,8.1 26.38,7.62 C28.1 27.09,7.42 C9.2 C5.2 | v20.5,17.5 22.09,15.91 R8.2 | U8.7 12.87,53.37 12.5,53 10.5,53 v9.5,54 8.5,55 8.5,63 9.4,63.9 12.98,63.9 | U8.19 12.98,62.53 12.98,63.9 | v20,63.5 19.6,63.9 12.98,63.9 | U14.1 U14.2 | U2.4 20.9,27.03 20.87,27
  Bottom 0.4: v5.5,17.5 v7,17.5 | v25.5,27 v19.5,27 18,28.5 v14.5,28.5 14.5,27.8 v10.5,23.8 4.7,23.8 v4.5,24 | v25.5,14.7 26.2,14 v27.5,14 | v24,18.5 23.89,18.61 21.61,18.61 v20.5,17.5 | v12.5,49.11 12.5,51 v9.5,54 | v20,63.5 38.75,63.5 J6.6
3V3_EXT
  Top 0.4: J5.1 50.78,10.18 | 50.78,10.18 49.81,9.21 U10.1 45.02,5.93 C11.2 | U10.3 49.85,11.11 50.78,10.18
3V3_REG  (via drill 0.35)
  Top 0.4: U10.4 43.23,11.11 L3.1 C13.2 43.06,13 v41,13 | v24,17 21.59,19.41 D4.A 22.5,21.31 v22.5,28 | v32.75,36.75 34.4,35.1 34.4,34.26 33.89,33.75 33.89,33.25 34.5,32.64 v34.5,31.5 | J7.5 32.75,50.38 32.75,43.75 v33,43.5
  Bottom 0.4: v41,13 26,13 24,15 v24,17 | v34.5,31.5 31,28 v22.5,28 | v33,43.5 33,37 v32.75,36.75
3V3_SENSE_IN
  Top 0.152: D4.C 21.59,25.68 U2.2 U2.1 20.15,25.22 U2.12 19.4,24.4 D5.C
3V3_USB  (via drill 0.35)
  Top 0.4: C7.2 R42.2 25.63,23.63 v25.5,23.5 | C7.2 C15.2 | C7.2 26.5,21 v25.01,21 | D5.A 19.9,20.4 v20,20.5 20,19.5 23,16.5 23,12 22.5,11.5 v21.5,11.5 | v14.5,11.5 13.66,10.66 U6.6 | v29,23.5 28,24.5 28,31.93 26.96,32.97 26.96,49.43 27.5,49.97 v27.5,53.61
  Bottom 0.4: v25.01,21 24.51,20.5 v20,20.5 | v21.5,11.5 21,12 15,12 v14.5,11.5 | v29,23.5 v25.5,23.5 | v27.5,53.61 33.44,53.61 J7.4
5V  (via drill 0.35)
  Top 0.4: D3.C 40.64,7.36 39.7,8.3 39.7,29.66 41.02,30.98 | 41.62,31 R48.2 41.02,30.98 | U$2.1 U$2.2 51.64,36.79 49.76,34.91 C24.2 47.09,34.91 v47,35 | 41.02,30.98 v40,32 37.02,32 U1.4 35.75,31.75 35.3,32.2 35.3,33.2 v35,33.5 35,36.27 33.17,38.1 33.17,41.14 34.29,42.26 U$3.4 34.29,50.79 35.5,52 41.5,52 42,52.5 42,56.5 45.87,60.37 J6.8 | R4.2 25,35.46 v25,33.5
  Bottom 0.4: v47,35 44,32 v40,32 | v25,33.5 v35,33.5
5V1  (via drill 0.35)
  Top 0.4: D3.A 40.56,3.81 R45.2 38.6,5 C6.2 33,5.5 v28.5,10 | v24.5,10 25.16,10.66 U14.5
  Bottom 0.4: v28.5,10 v24.5,10
5V_EXT
  Top 0.4: U6.2 9.74,10.16 C4.2 8.89,6.43 D1.C
ADC_IN  (via drill 0.35)
  Top 0.152: U3.3 7.63,26.36 6.5,27.5 v6.5,29.5 | v10.5,29.5 11.25,30.25 U7.8 11.25,36.05 v14.2,39 | v32,45.5 32,50.78 36.69,55.47 36.69,56.69 39,59 41.5,59 43.33,60.83 J6.7
  Bottom 0.152: v6.5,29.5 v10.5,29.5 | v14.2,39 25.5,39 v32,45.5
D1
  Top 0.152: U7.12 16.33,32.91 12.8,29.38 12.8,25 13.37,24.43 U3.11
D2
  Top 0.152: U3.10 15.27,23.77 16.5,25 16.5,31.5 17.6,32.6 U7.13
D3
  Top 0.152: U7.14 18.87,31.87 17,30 17,24.5 15.61,23.11 U3.9
DOPP_IN  (via drill 0.35)
  Top 0.152: R7.2 25.4,37.4 v24.5,36.5 | R6.1 28,38.04 v28,36.5 | v18.5,37.5 18.5,47.5 18.62,47.62 U7.24
  Bottom 0.152: v18.5,37.5 19.5,36.5 v24.5,36.5 v28,36.5
DTR  (via drill 0.35)
  Top 0.152: R43.1 10.49,17.49 | 10.49,17.49 11.11,16.87 Q2.2 U5.28 | v30,22.5 v30,35.5 | v41.5,38 41.5,45.28 43.33,47.11 J7.7 | v10.5,18.5 10.5,17.5 10.49,17.49
  Bottom 0.152: v10.5,18.5 12,20 14.07,20 15.87,21.8 24.3,21.8 25,22.5 27.64,22.5 27.75,22.61 28.25,22.61 28.36,22.5 v30,22.5 | v30,35.5 40,35.5 41.5,37 v41.5,38
EN  (via drill 0.35)
  Top 0.152: v25.5,26 26.5,26 R39.1 R42.1 25.63,24.63 v25.5,24.5 | Q1.3 23.5,30.1 v23.5,26 | Q1.3 22.02,30.48 v22,30.5 | v6,31 4.9,32.1 U7.3 | U$6.P$4 34.29,9.07 C25.1 | C25.1 C26.1 C16.1 | C25.1 32,14.34 v32,24.5 | Q1.3 23.12,33.12 23.89,33.89 23.89,39.09 25,40.19 v25,51.5 | J7.6 40.79,53.29 v40.5,53
  Bottom 0.152: v25.5,26 v23.5,26 | v22,30.5 8.36,30.5 8.25,30.39 6.61,30.39 v6,31 | v32,24.5 v25.5,24.5 | v25,51.5 26.5,53 v40.5,53
GND  (via drill 0.35)  (1 unrouted)
  Top 0.152: U5.3 16.01,14.74 U5.29
  other vias: 42,21.5 36,24.5 42.5,29 29,36.5 24,7 22,7 10,45 3.5,47.5 3.5,41.5 3.5,37 9.5,37.5 20.5,58.5 20.5,53
  pour Top: -0.5,66.5 -0.5,-0.5 1,-2 58.5,-2 61,0.5 61,65 57.5,68.5 1.5,68.5
  pour Bottom: 1.5,68.5 -0.5,66.5 -0.5,-0.5 1,-2 58.5,-2 61,0.5 61,65 57.5,68.5
I2C_SCL  (via drill 0.35)
  Top 0.152: 5,50.76 U7.36 5,50.56 | 5,50.56 v5,36 | v5,31 5.5,30.5 5.5,20 6.35,19.15 R63.1 6.12,15.51 U9.6 | v8.5,52.5 14.5,52.5 15.37,53.37 U8.9 15.37,55.37 15.5,55.5 17.06,55.5 17.28,55.28 18.96,55.28 26.14,62.46 32.17,62.46 J6.3 | v5,52.5 5,50.56
  Bottom 0.152: v5,36 v5,31 | v5,52.5 v8.5,52.5
I2C_SDA  (via drill 0.35)
  Top 0.152: U7.33 8.71,51.5 9.21,52 16,52 16.62,52.62 U8.10 16.7,54.5 v20.5,54.5 | U9.1 3.31,16.54 R62.1 3,17.84 v3,31 | v3.4,35.4 v3.41,35.39 5.25,35.39 7.5,37.64 7.5,45 8.71,46.21 U7.33 | U7.33 9,50.95
  Bottom 0.152: v3,31 3,35 v3.4,35.4 | J6.1 28.09,59.59 25,56.5 22.5,56.5 v20.5,54.5
IO0  (via drill 0.35)
  Top 0.152: v10,12.5 10.16,12.66 Q2.3 10.16,16.84 v10,17 | v32,11.99 32,8.86 U$6.P$1 | 19.03,50.5 U7.25 20.84,50.66 v21,50.5 21,50.68 C27.1 24.96,53.96 v25.5,54.5 | v28,22 27.5,22.5 27.5,31.5 26.5,32.5 v26.5,50.5 26.67,50.67
  Bottom 0.152: v10,12.5 31.49,12.5 v32,11.99 | v10,17 11.5,17 16,21.5 24.65,21.5 24.75,21.61 27.61,21.61 v28,22 | v21,50.5 v26.5,50.5 | J7.3 31.79,54.5 v25.5,54.5
N$1  (via drill 0.35)
  Top 0.4: U12.1 10.16,5.16 D1.A 11.5,6.5 v13,6.5 13.86,6.5 J2.1 | R3.2 23,9.52 v23,6
  Bottom 0.4: v23,6 13.5,6 v13,6.5
N$2  (via drill 0.35)
  Top 0.152: R5.2 28.5,35 v28.5,34.5 | v33.5,34.5 33.29,34.29 U1.9 | R4.1 v25.9,34.51 v25.89,34.5
  Bottom 0.152: v33.5,34.5 v28.5,34.5 v25.89,34.5
N$3
  Top 0.152: C23.1 40.79,34.91 R52.1 | R52.1 39.87,34.29 U1.6 | R51.2 38.6,37.1 R52.1
N$4  (via drill 0.35)
  Top 0.152: U$9.P$1 45.45,34.55 44,36 43.39,36 C23.2 40.79,36.21 R52.2 40.5,36.2 v40.5,37 | v37,37 37,35.8 U1.7
  Bottom 0.152: v40.5,37 v37,37
N$5  (via drill 0.35)
  Top 0.152: U$9.P$2 45.45,24.75 45.95,24.25 45.95,21.46 45.5,21.02 v45.5,20.5 | v36,20.5 35.82,20.32 R53.1
  Bottom 0.152: v45.5,20.5 v36,20.5
N$6
  Top 0.152: U1.3 36.74,30.5 35,30.5 34.29,29.79 34.29,25.9 R54.1 33.79,23.01 C22.1 33.64,20.47 R53.2
N$7  (via drill 0.35)
  Top 0.152: U2.10 17.7,25.92 17.5,26.12 17.5,29 22,33.5 22,45.5 v23.5,47 | U2.10 17.92,25.92 | U3.13 15.66,25.73 v15.89,25.5 | v18,24.5 18,25.72 U2.10 | J6.4 31.61,57.36 31.61,52.75 30,51.14 30,49 28.5,47.5 v28,47.5
  Bottom 0.152: v15.89,25.5 17,25.5 v18,24.5 | v28,47.5 27.5,47 v23.5,47
N$8
  Top 0.152: R6.2 31.48,35.56 U1.8
N$10
  Top 0.152: R51.1 38.1,39.37 U$7.P$1
N$11
  Top 0.152: U14.4 27.06,9 28.5,9 33.69,3.81 R45.1
N$12  (via drill 0.35)
  Top 0.152: v40.61,29 40.66,29 R48.1 R49.2 41.64,28.41 41.06,27.84 41.06,26.55 41.5,26.11 v41.5,26 41.64,25.86 R55.2 | v38.7,29 36.98,29 U1.2 | C8.1 38.1,25.4 v38.7,26
  Bottom 0.152: v40.61,29 v38.7,29 | v38.7,26 v41.5,26
N$13  (via drill 0.35)
  Top 0.152: U4.1 21.96,2.54 21,3.5 16.5,3.5 15.86,4.14 J2.2 15.9,5.19 v15.9,10.89 | U5.5 17.01,11 v17.12,10.89
  Bottom 0.152: v17.12,10.89 v15.9,10.89
N$14
  Top 0.152: U11.1 22.05,3.81 17,3.81 16.51,4.29 J2.3 U5.4
N$15
  Top 0.152: R3.1 22,10.66 21.84,10.66 20.84,10.66 19.91,11.59 19.91,12.7 | 21,12.61 R1.2 19.91,12.7 | 19.91,12.7 U5.8
N$16  (via drill 0.35)
  Top 0.152: v23,41 23,34 19.5,30.5 v19.5,29.5 | U3.14 15.37,26.36 15.5,26.5 v15.5,29.5 | v29,50 29,54.96 29.07,55.03 29.07,59.9 J6.2
  Bottom 0.152: U$3.1 41.91,48.45 40.37,46.9 28.9,46.9 | 28.9,46.9 29,47 v29,50 | 28.9,46.9 v23,41 | v19.5,29.5 v15.5,29.5
N$17  (via drill 0.35)
  Top 0.152: R1.1 22.09,13.91 v22,14 | v23.8,14 24.13,13.67 R2.1
  Bottom 0.152: v22,14 v23.8,14
N$18
  Top 0.152: R8.1 20.09,14.24 U5.9
N$20
  Top 0.152: U3.8 6.87,23.11 R61.1
N$21
  Top 0.152: U3.6 6.54,24.43 R61.2
N$22
  Top 0.152: C10.2 17.98,9.54 | 17.98,9.54 18.01,9.57 U5.7 U5.6 | C14.2 17.98,9.54
N$24  (via drill 0.35)
  Top 0.152: R43.2 10.5,20.62 v10.5,22 | 25.03,29.53 Q1.1 24.53,29.53 24,29 24,26.36 24.11,26.25 24.11,25.75 23.8,25.44 v23.8,22.5
  Bottom 0.152: v23.8,22.5 11,22.5 v10.5,22
N$25
  Top 0.152: R44.2 9.21,17.52 Q2.1
N$29
  Top 0.152: U$1.1 U$1.2 48.02,24.39 U$8.P$1 48.29,23.13 R50.2
N$55
  Top 0.152: U10.5 45.63,9.16 L3.2
N$56
  Top 0.152: U14.6 25.9,13.9 27.4,15.4 L4.1
N$60  (via drill 0.35)
  Top 0.152: R55.1 41.87,23.63 42.5,23 44.28,23 U$8.P$2 | 41.51,23.5 R55.1 | U1.5 38.48,33.02 v38.5,33 | v43.5,33 43.5,25.49 R55.1
  Bottom 0.152: v38.5,33 v43.5,33
RTS  (via drill 0.35)
  Top 0.152: U5.24 13.26,15.74 12.5,16.5 12.5,20 | 12.5,20 12.5,30.61 v13,31.11 | v26.5,31.5 26.43,31.43 Q1.2 | v8.5,21 8.14,20.64 R44.1 | v13.5,21 12.5,20 | v29,31.5 29,32 27.39,33.61 27.39,39.39 31,43 v31,51 | J7.8 45.87,51.63 v46,51.5
  Bottom 0.152: v13,31.11 26.11,31.11 v26.5,31.5 v29,31.5 | v8.5,21 v13.5,21 | v46,51.5 45.5,51 v31,51
RXD0  (via drill 0.35)
  Top 0.152: U7.34 7.44,48.56 v7.5,48.5 | U5.26 13.26,14.74 11.5,16.5 11.5,26.5 v7,31 | J7.2 30.63,52.91 v29.86,52.14
  Bottom 0.152: v7,31 7,48 v7.5,48.5 24,48.5 26.21,48.5 v29.86,52.14
THRESH_NET  (via drill 0.35)
  Top 0.152: C22.2 34.79,23.01 R54.2 36.77,27.38 U1.1 35.06,27.94 v35,28 | v33.5,28 33.5,32.5 32.98,33.02 U1.10
  Bottom 0.152: v35,28 v33.5,28
TXD0  (via drill 0.35)
  Top 0.152: v8,31 12,27 12,16.5 13.26,15.24 U5.25 | v8,47 6.17,48.83 U7.35 | v21.89,47 21.89,49.68 J7.1
  Bottom 0.152: v8,31 v8,47 v21.89,47

### Text on the board
tPlace: MQ_7 | CURR | 3V3_BRD | 5V | I2C_SDA | I2C_SCL | 555_OUT | ADC_IN | RXD0 | 3V3_USB | EN | RTSN | TXD0 | IO0 | 3V3_REG | DTRN | GND | 5V | Sensor Output